# Altium schematic sheet Indication.SchDoc
size 420 x 297 mm; Address1: Address1; Address2: Address2; Address3: Address3; Address4: Address4; DocumentNumber: *Э3; SheetNumber: 10; SheetTotal: 15; DocumentType: Схема электрическая *
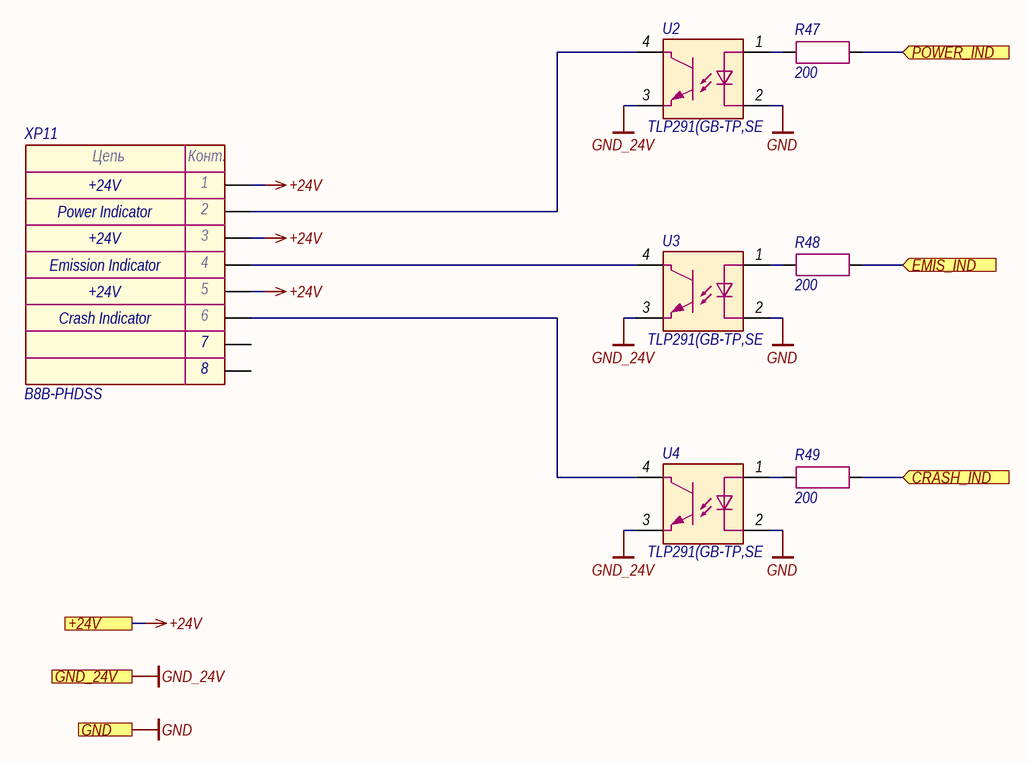
[diagram p0: Indication.SchDoc]

## Parts
R47  200  [RES_0603]
R48  200  [RES_0603]
R49  200  [RES_0603]
U2  TLP291(GB-TP,SE  [11-3C1]
U3  TLP291(GB-TP,SE  [11-3C1]
U4  TLP291(GB-TP,SE  [11-3C1]
XP11  B8B-PHDSS  [B8B-PHDSS]

## Ports
+24V (see Main[2C], Button[1C], Column[1C], Flow_sensor[2C], Hardwiring[3C], LD_driver[1C], Power_supply[1D], Power_supply_CAN[1D]), CRASH_IND (in, see Main[2D]), EMIS_IND (in, see Main[2C]), GND (see Main[2D], Button[1D], Column[1C], Ethernet[3D], Fiber_interlock[2C], Flow_sensor[2C], Guide_laser[1C], Hardwiring[3D], LD_driver[1D], Power_supply[1D], Power_supply_CAN[1D], SF_driver[2D]), GND_24V (see Main[2C], Button[1D], Column[1C], Flow_sensor[2C], Hardwiring[3C], LD_driver[1D], Power_supply[1D], Power_supply_CAN[1D]), POWER_IND (in, see Main[2C])

## Nets
+24V: XP11.1 XP11.3 XP11.5 ; port +24V
GND: U2.2 U3.2 U4.2 ; port GND
GND_24V: U2.3 U3.3 U4.3 ; port GND_24V
CRASH_IND: R49.2 ; port CRASH_IND
EMIS_IND: R48.2 ; port EMIS_IND
POWER_IND: R47.2 ; port POWER_IND
NetR47_1: R47.1 U2.1
NetR48_1: R48.1 U3.1
NetR49_1: R49.1 U4.1
NetU2_4: U2.4 XP11.2
NetU3_4: U3.4 XP11.4
NetU4_4: U4.4 XP11.6

Not connected (* = marked no-connect by the designer): XP11 7 8

## Notes on the sheet
- Power Indicator
- +24V
- (near XP11) Emission Indicator
- Crash Indicator
- Подп. и дата
- Инв. № дубл.
- Взам. инв. №
- Инв. № подл.
- Изм.
- Лист
- № докум.
- Подп.
- Дата
- Копировал
- Формат А3
- (in symbol Connector-8) Цепь; Конт.

## Library data of the parts
R47-R49 = Resistor: Manufacturer: Yageo; Model: RC0603FR-07200RL; Value: 200; Document: *
U2-U4 = TLP291: Manufacturer: Toshiba; Model: TLP291(GB-TP,SE; Document: *
XP11 = Connector-8: Manufacturer: JST; Model: B8B-PHDSS; Document: *